# Altium schematic sheet v2-DCSupplyHub-current.SchDoc
size A4; SheetNumber: 2; SheetTotal: 3
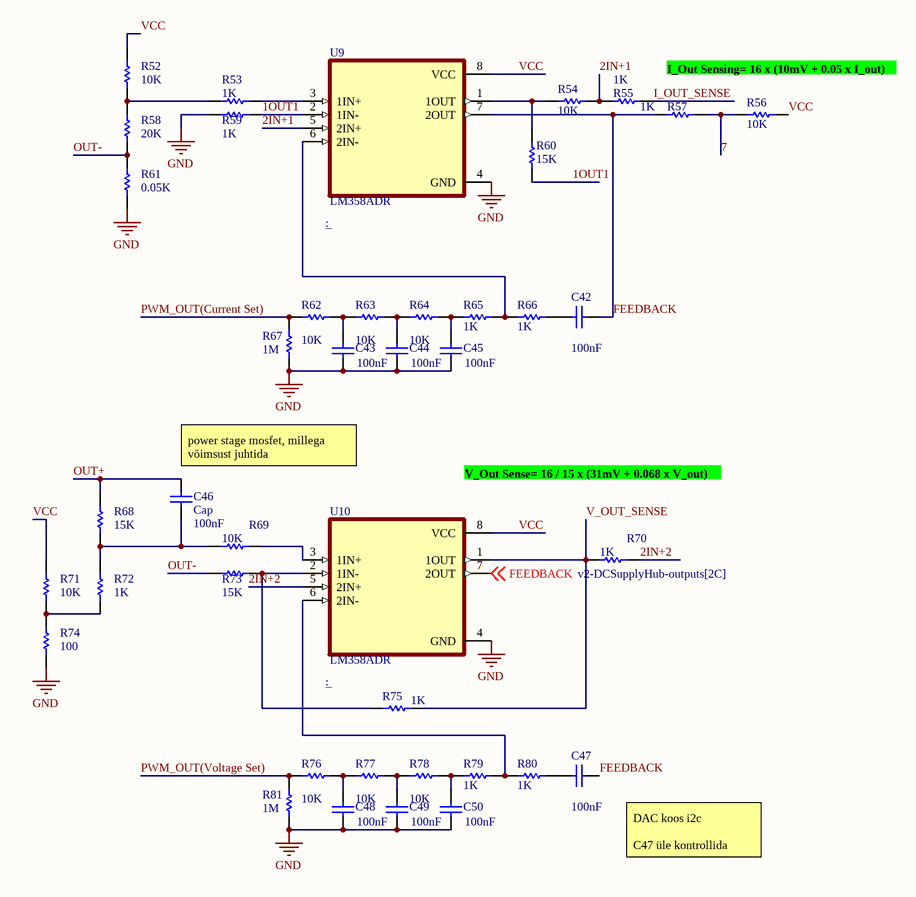
[diagram p0: v2-DCSupplyHub-current.SchDoc]

## Parts
C42  value 100nF  [CAPC3216X110N]  (hidden comment: Cap)
C43  value 100nF  [CAPC3216X110N]  (hidden comment: Cap)
C44  value 100nF  [CAPC3216X110N]  (hidden comment: Cap)
C45  value 100nF  [CAPC3216X110N]  (hidden comment: Cap)
C46  Cap  value 100nF  [CAPC3216X110N]
C47  value 100nF  [CAPC3216X110N]  (hidden comment: Cap)
C48  value 100nF  [CAPC3216X110N]  (hidden comment: Cap)
C49  value 100nF  [CAPC3216X110N]  (hidden comment: Cap)
C50  value 100nF  [CAPC3216X110N]  (hidden comment: Cap)
R52  value 10K  [RESC3116X60N]  (hidden comment: Res1)
R53  value 1K  [RESC3116X60N]  (hidden comment: Res1)
R54  value 10K  [RESC3116X60N]  (hidden comment: Res1)
R55  value 1K  [RESC3116X60N]  (hidden comment: Res1)
R56  value 10K  [RESC3116X60N]  (hidden comment: Res1)
R57  value 1K  [RESC3116X60N]  (hidden comment: Res1)
R58  value 20K  [RESC3116X60N]  (hidden comment: Res1)
R59  value 1K  [RESC3116X60N]  (hidden comment: Res1)
R60  value 15K  [RESC3116X60N]  (hidden comment: Res1)
R61  value 0.05K  [RESC3116X60N]  (hidden comment: Res1)
R62  value 10K  [RESC3116X60N]  (hidden comment: Res1)
R63  value 10K  [RESC3116X60N]  (hidden comment: Res1)
R64  value 10K  [RESC3116X60N]  (hidden comment: Res1)
R65  value 1K  [RESC3116X60N]  (hidden comment: Res1)
R66  value 1K  [RESC3116X60N]  (hidden comment: Res1)
R67  value 1M  [RESC3116X60N]  (hidden comment: Res1)
R68  value 15K  [RESC3116X60N]  (hidden comment: Res1)
R69  value 10K  [RESC3116X60N]  (hidden comment: Res1)
R70  value 1K  [RESC3116X60N]  (hidden comment: Res1)
R71  value 10K  [RESC3116X60N]  (hidden comment: Res1)
R72  value 1K  [RESC3116X60N]  (hidden comment: Res1)
R73  value 15K  [RESC3116X60N]  (hidden comment: Res1)
R74  value 100  [RESC3116X60N]  (hidden comment: Res1)
R75  value 1K  [RESC3116X60N]  (hidden comment: Res1)
R76  value 10K  [RESC3116X60N]  (hidden comment: Res1)
R77  value 10K  [RESC3116X60N]  (hidden comment: Res1)
R78  value 10K  [RESC3116X60N]  (hidden comment: Res1)
R79  value 1K  [RESC3116X60N]  (hidden comment: Res1)
R80  value 1K  [RESC3116X60N]  (hidden comment: Res1)
R81  value 1M  [RESC3116X60N]  (hidden comment: Res1)
U9  LM358ADR  [SOIC127P599X175-8N]
U10  LM358ADR  [SOIC127P599X175-8N]

## Nets
GND: C43.1 C44.1 C45.1 C48.1 C49.1 C50.1 R59.1 R61.1 R67.1 R74.1 R81.1 U9.4(GND) U10.4(GND)
1OUT1: R59.2 R60.1 U9.2(1IN-)
2IN+1: R54.1 R55.2 U9.5(2IN+)
2IN+2: R70.2 U10.5(2IN+)
7: R56.2 R57.1
FEEDBACK: C42.2 C47.2 R57.2 U9.7(2OUT) U10.7(2OUT) ; off-sheet FEEDBACK
I_OUT_SENSE: R55.1
OUT+: C46.1 R68.2
OUT-: R58.1 R61.2 R73.1
PWM_OUT(Current Set): R62.2 R67.2
PWM_OUT(Voltage Set): R76.2 R81.2
V_OUT_SENSE: R70.1 R75.2 U10.1(1OUT)
VCC: R52.2 R56.1 R71.2 U9.8(VCC) U10.8(VCC)
NetC42_1: C42.1 R66.2
NetC43_2: C43.2 R62.1 R63.2
NetC44_2: C44.2 R63.1 R64.2
NetC45_2: C45.2 R64.1 R65.1
NetC46_2: C46.2 R68.1 R69.1 R72.2
NetC47_1: C47.1 R80.2
NetC48_2: C48.2 R76.1 R77.2
NetC49_2: C49.2 R77.1 R78.2
NetC50_2: C50.2 R78.1 R79.1
NetR52_1: R52.1 R53.1 R58.2
NetR53_2: R53.2 U9.3(1IN+)
NetR54_2: R54.2 R60.2 U9.1(1OUT)
NetR65_2: R65.2 R66.1 U9.6(2IN-)
NetR69_2: R69.2 U10.3(1IN+)
NetR71_1: R71.1 R72.1 R74.2
NetR73_2: R73.2 R75.1 U10.2(1IN-)
NetR79_2: R79.2 R80.1 U10.6(2IN-)

## Notes on the sheet
- I_Out Sensing= 16 x (10mV + 0.05 x I_out)
- (near C46) power stage mosfet, millega võimsust juhtida
- V_Out Sense= 16 / 15 x (31mV + 0.068 x V_out)
- (near C47) DAC koos i2c
  C47 üle kontrollida

## Library data of the parts
C42-C50 = Cap: Capacitor; Published: 8-Jun-2000; LatestRevisionDate: 17-Jul-2002; LatestRevisionNote: Re-released for DXP Platform.; PackageReference: RAD-0.3; Publisher: Altium Limited; PackageDescription: Radial Cap, Thru-Hole; 2 Leads; 0.3 in Pin Spacing
R52-R81 = Res1: Resistor; Published: 8-Jun-2000; LatestRevisionDate: 17-Jul-2002; LatestRevisionNote: Re-released for DXP Platform.; PackageReference: AXIAL-0.3; Publisher: Altium Limited; PackageDescription: Axial Device, Thru-Hole; 2 Leads; 0.3 in Pin Spacing
U9 U10 = LM358ADR: Dual improved offset, standard operational amplifier<br /> &nbsp; 8-SOIC 0 to 70; MF: Texas Instruments; DigiKey-Purchase-URL: https://snapeda.com/shop?store=DigiKey&id=348453; Mouser-Purchase-URL: https://snapeda.com/shop?store=Mouser&id=348453; SnapEDA_Link: https://www.snapeda.com/parts/LM358ADR/Texas%20Instruments/view-part/348453/?ref=snap; Price: None; MP: LM358ADR; Value: *; Availability: Good; Texas_Instruments-Purchase-URL: https://snapeda.com/shop?store=Texas+Instruments&id=348453; Package: SOIC-8 Texas Instruments